# EAGLE design BMS_MCUV1.0 (EAGLE 9.2.0)
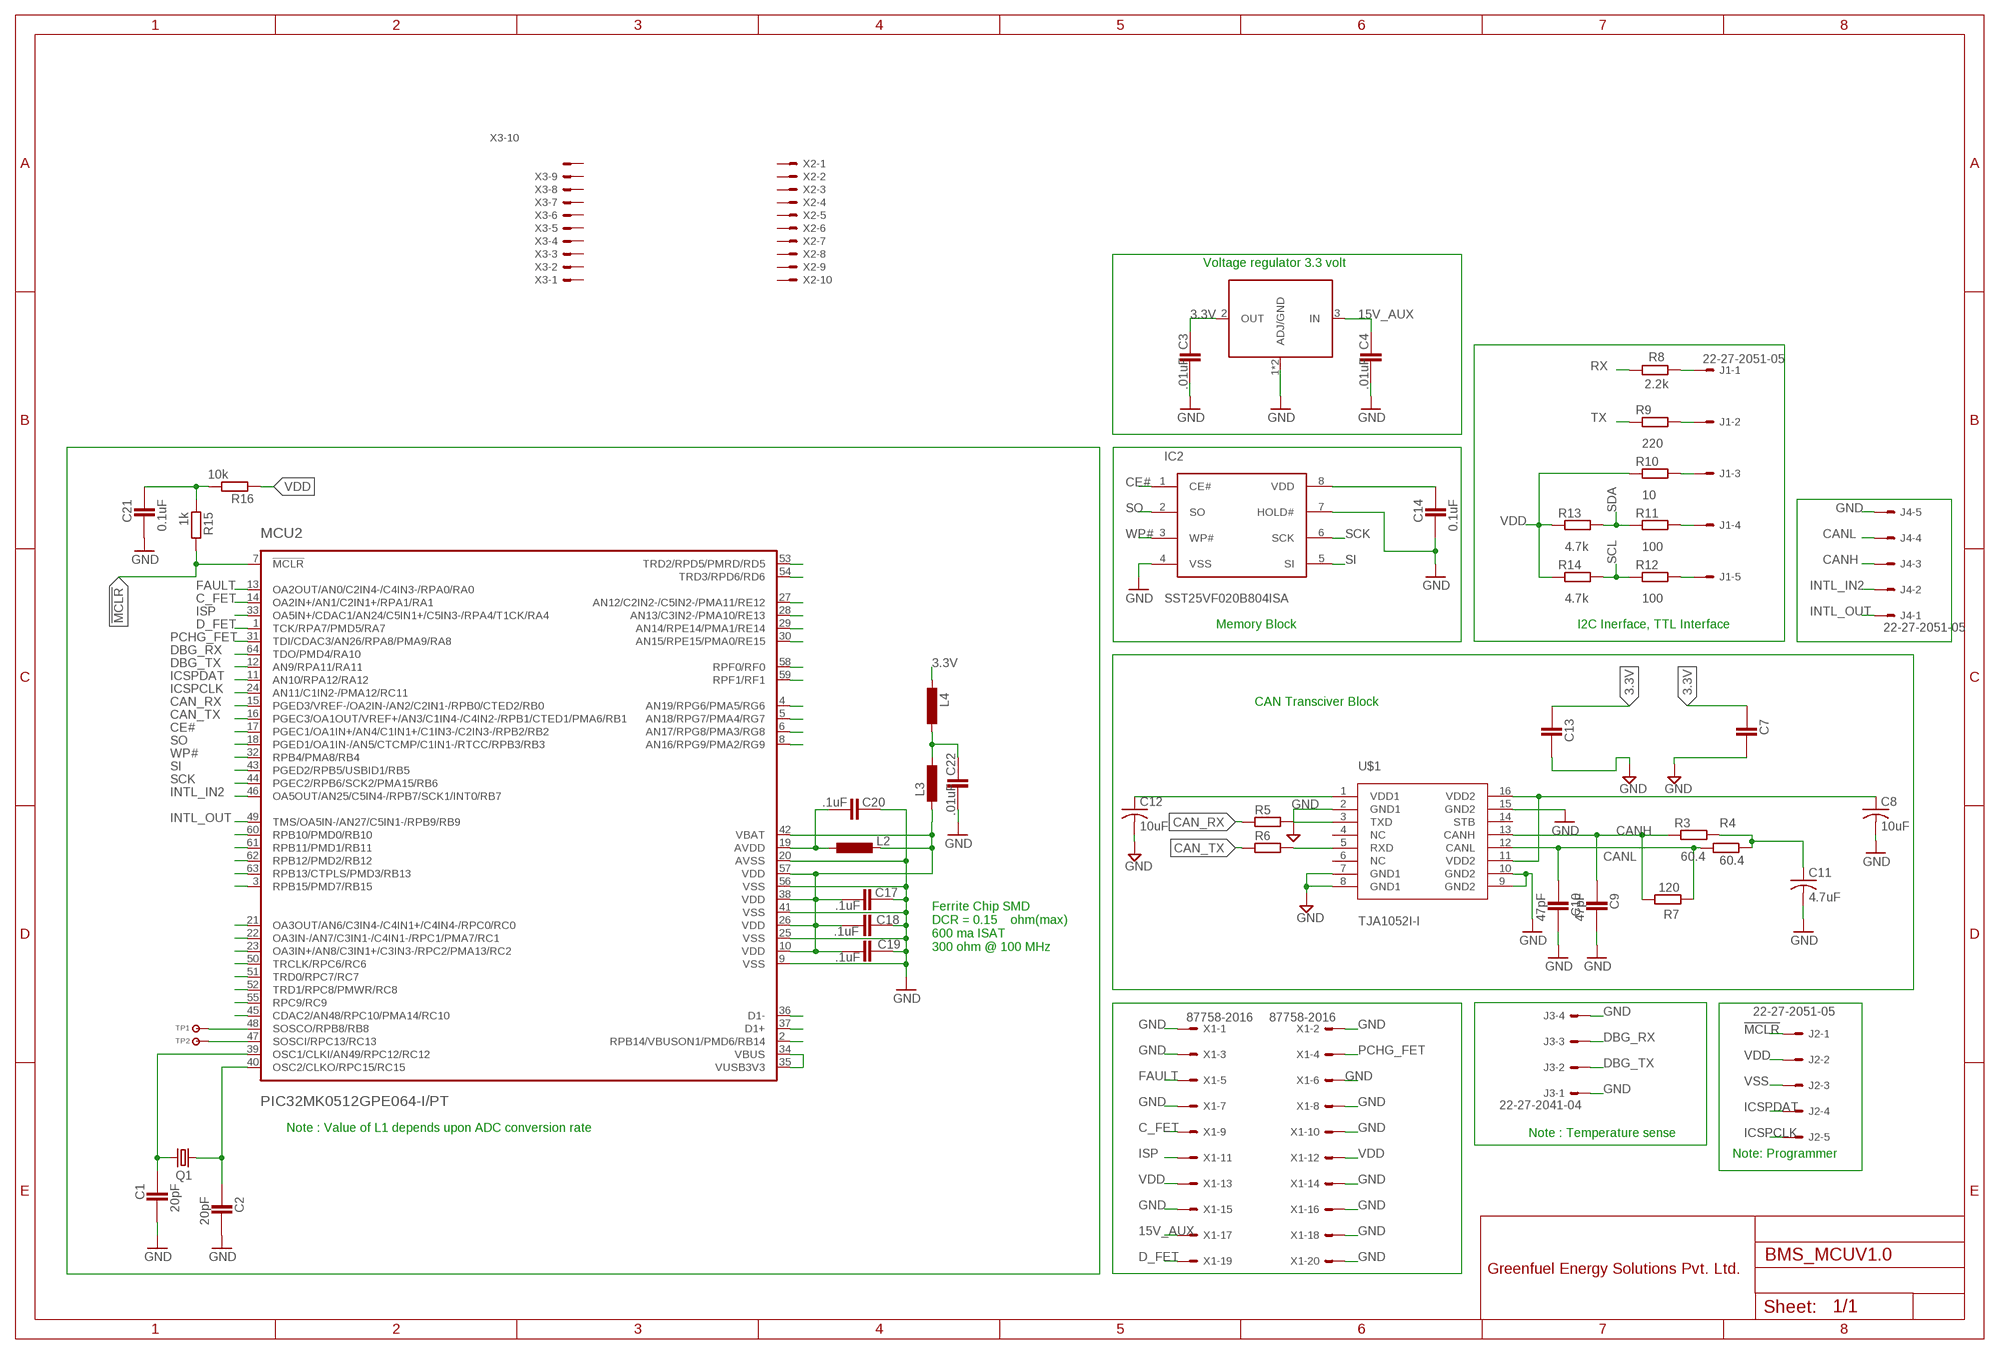
[diagram p0: schematic, sheet 1]

## Parts
C1  20pF  CAPACITOR_0603  [CAPC1608X92N]
C2  20pF  CAPACITOR_0603  [CAPC1608X92N]
C3  .01uF  CAPACITOR_0603  [CAPC1608X92N]
C4  .01uF  CAPACITOR_0603  [CAPC1608X92N]
C7  CAPACITOR_0805  [CAPC2012X145AN]
C8  10uF  C-USC0805  [C0805]
C9  47pF  CAPACITOR_0805  [CAPC2012X145AN]
C10  47pF  CAPACITOR_0805  [CAPC2012X145AN]
C11  4.7uF  C-USC0805  [C0805]
C12  10uF  C-USC0805  [C0805]
C13  CAPACITOR_0805  [CAPC2012X145AN]
C14  0.1uF  CAPACITOR_0603  [CAPC1608X92N]
C17  .1uF  CAPACITOR_0603  [CAPC1608X92N]
C18  .1uF  CAPACITOR_0603  [CAPC1608X92N]
C19  .1uF  CAPACITOR_0603  [CAPC1608X92N]
C20  .1uF  CAPACITOR_0603  [CAPC1608X92N]
C21  0.1uF  CAPACITOR_0603  [CAPC1608X92N]
C22  .01uF  CAPACITOR_0603  [CAPC1608X92N]
IC2  SST25VF020B804ISA  [SOIC127P600X175-8N]
J1  22-27-2051-05  [6410-05]
J2  22-27-2051-05  [6410-05]
J3  22-27-2041-04  [6410-04]
J4  22-27-2051-05  [6410-05]
L2  INDUCTOR_0603  [INDC1608X95N]
L3  INDUCTOR_0603  [INDC1608X95N]
L4  INDUCTOR_0603  [INDC1608X95N]
MCU2  PIC32MK0512GPE064-I/PT  [TQFP-64-I/PT]
Q1  CRYSTALCTS406  [CTS406]
R3  60.4  RESISTOR_0805  [RESC2012X70N]
R4  60.4  RESISTOR_0805  [RESC2012X70N]
R5  RESISTOR_0805  [RESC2012X70N]
R6  RESISTOR_0805  [RESC2012X70N]
R7  120  RESISTOR_0805  [RESC2012X70N]
R8  2.2k  RESISTOR_0805  [RESC2012X70N]
R9  220  RESISTOR_0805  [RESC2012X70N]
R10  10  RESISTOR_0805  [RESC2012X70N]
R11  100  RESISTOR_0805  [RESC2012X70N]
R12  100  RESISTOR_0805  [RESC2012X70N]
R13  4.7k  RESISTOR_0805  [RESC2012X70N]
R14  4.7k  RESISTOR_0805  [RESC2012X70N]
R15  1k  RESISTOR_0603  [RESC1608X55N]
R16  10k  RESISTOR_0603  [RESC1608X55N]
TP1  TP-SMD60  [TP-SMD60]
TP2  TP-SMD60  [TP-SMD60]
U1  NCP1117LP-PG  [SOT-223]
U$1  TJA1052I-I  [SOT162-1]
X1  87758-2016  [87758-2016]
X2  KK-156-10  [KK-156-10]
X3  KK-156-10  [KK-156-10]

## Nets
3.3V: C3.2 C7.1 C13.1 L4.1 U1.2(OUT)
15V_AUX: C4.2 U1.3(IN) X1.17
!MCLR: J2.1 MCU2.7(!MCLR) R15.2
C_FET: MCU2.14(OA2IN+/AN1/C2IN1+/RPA1/RA1) X1.9
CAN_RX: MCU2.15(PGED3/VREF-/OA2IN-/AN2/C2IN1-/RPB0/CTED2/RB0) R5.1
CAN_TX: MCU2.16(PGEC3/OA1OUT/VREF+/AN3/C1IN4-/C4IN2-/RPB1/CTED1/PMA6/RB1) R6.1
CANH: C9.1 J4.3 R3.1 R7.2 U$1.13(CANH)
CANL: C10.1 J4.4 R4.1 R7.1 U$1.12(CANL)
CE#: IC2.1(CE#) MCU2.17(PGEC1/OA1IN+/AN4/C1IN1+/C1IN3-/C2IN3-/RPB2/RB2)
D_FET: MCU2.1(TCK/RPA7/PMD5/RA7) X1.19
DBG_RX: J3.3 MCU2.64(TDO/PMD4/RA10)
DBG_TX: J3.2 MCU2.12(AN9/RPA11/RA11)
FAULT: MCU2.13(OA2OUT/AN0/C2IN4-/C4IN3-/RPA0/RA0) X1.5
GND: C1.2 C2.2 C3.1 C4.1 C7.2 C8.2 C9.2 C10.2 C11.2 C12.2 C13.2 C14.2 C17.2 C18.2 C19.2 C20.2 C21.2 C22.1 IC2.4(VSS) IC2.7(HOLD#) J3.1 J3.4 J4.5 MCU2.9(VSS) MCU2.20(AVSS) MCU2.25(VSS) MCU2.41(VSS) MCU2.56(VSS) U1.1(ADJ/GND) U1.4(ADJ/GND) U$1.2(GND1) U$1.7(GND1) U$1.8(GND1) U$1.9(GND2) U$1.10(GND2) U$1.15(GND2) X1.1 X1.2 X1.3 X1.6 X1.7 X1.8 X1.10 X1.14 X1.15 X1.16 X1.18 X1.20
ICSPCLK: J2.5 MCU2.24(AN11/C1IN2-/PMA12/RC11)
ICSPDAT: J2.4 MCU2.11(AN10/RPA12/RA12)
INTL_IN2: J4.2 MCU2.46(OA5OUT/AN25/C5IN4-/RPB7/SCK1/INT0/RB7)
INTL_OUT: J4.1 MCU2.49(TMS/OA5IN-/AN27/C5IN1-/RPB9/RB9)
ISP: MCU2.33(OA5IN+/CDAC1/AN24/C5IN1+/C5IN3-/RPA4/T1CK/RA4) X1.11
N$1: C1.1 MCU2.39(OSC1/CLKI/AN49/RPC12/RC12) Q1.3
N$2: C2.1 MCU2.40(OSC2/CLKO/RPC15/RC15) Q1.1
N$5: MCU2.48(SOSCO/RPB8/RB8) TP1.P$1
N$6: R6.2 U$1.5(RXD)
N$7: R5.2 U$1.3(TXD)
N$8: C12.1 U$1.1(VDD1)
N$9: MCU2.53(TRD2/RPD5/PMRD/RD5)
N$10: MCU2.54(TRD3/RPD6/RD6)
N$11: C11.1 R3.2 R4.2
N$12: C8.1 U$1.11(VDD2) U$1.16(VDD2)
N$14: C14.1 IC2.8(VDD)
N$16: MCU2.47(SOSCI/RPC13/RC13) TP2.P$1
N$18: J1.1 R8.2
N$19: J1.2 R9.2
N$20: J1.3 R10.2
N$21: J1.4 R11.2
N$22: J1.5 R12.2
N$29: MCU2.27(AN12/C2IN2-/C5IN2-/PMA11/RE12)
N$30: MCU2.28(AN13/C3IN2-/PMA10/RE13)
N$32: C20.1 L2.1 MCU2.19(AVDD)
N$33: C22.2 L3.2 L4.2
N$34: C21.1 R15.1 R16.2
N$40: MCU2.29(AN14/RPE14/PMA1/RE14)
N$41: MCU2.30(AN15/RPE15/PMA0/RE15)
N$42: MCU2.58(RPF0/RF0)
N$43: MCU2.59(RPF1/RF1)
N$44: MCU2.4(AN19/RPG6/PMA5/RG6)
N$45: MCU2.5(AN18/RPG7/PMA4/RG7)
N$46: MCU2.6(AN17/RPG8/PMA3/RG8)
N$47: MCU2.8(AN16/RPG9/PMA2/RG9)
N$66: MCU2.60(RPB10/PMD0/RB10)
N$67: MCU2.61(RPB11/PMD1/RB11)
N$68: MCU2.62(RPB12/PMD2/RB12)
N$69: MCU2.63(RPB13/CTPLS/PMD3/RB13)
N$70: MCU2.3(RPB15/PMD7/RB15)
N$71: MCU2.21(OA3OUT/AN6/C3IN4-/C4IN1+/C4IN4-/RPC0/RC0)
N$72: MCU2.22(OA3IN-/AN7/C3IN1-/C4IN1-/RPC1/PMA7/RC1)
N$73: MCU2.23(OA3IN+/AN8/C3IN1+/C3IN3-/RPC2/PMA13/RC2)
N$74: MCU2.50(TRCLK/RPC6/RC6)
N$75: MCU2.51(TRD0/RPC7/RC7)
N$76: MCU2.52(TRD1/RPC8/PMWR/RC8)
N$77: MCU2.55(RPC9/RC9)
N$78: MCU2.45(CDAC2/AN48/RPC10/PMA14/RC10)
N$79: MCU2.36(D1-)
N$80: MCU2.37(D1+)
N$81: MCU2.2(RPB14/VBUSON1/PMD6/RB14)
N$82: MCU2.34(VBUS) MCU2.35(VUSB3V3)
PCHG_FET: MCU2.31(TDI/CDAC3/AN26/RPA8/PMA9/RA8) X1.4
RX: R8.1
SCK: IC2.6(SCK) MCU2.44(PGEC2/RPB6/SCK2/PMA15/RB6)
SCL: R12.1 R14.2
SDA: R11.1 R13.2
SI: IC2.5(SI) MCU2.43(PGED2/RPB5/USBID1/RB5)
SO: IC2.2(SO) MCU2.18(PGED1/OA1IN-/AN5/CTCMP/C1IN1-/RTCC/RPB3/RB3)
TX: R9.1
VDD: C17.1 C18.1 C19.1 J2.2 L2.2 L3.1 MCU2.10(VDD) MCU2.26(VDD) MCU2.38(VDD) MCU2.42(VBAT) MCU2.57(VDD) R10.1 R13.1 R14.1 R16.1 X1.12 X1.13
VSS: J2.3
WP#: IC2.3(WP#) MCU2.32(RPB4/PMA8/RB4)
Unconnected: U$1.4(NC) U$1.6(NC) U$1.14(STB) X2.1 X2.2 X2.3 X2.4 X2.5 X2.6 X2.7 X2.8 X2.9 X2.10 X3.1 X3.2 X3.3 X3.4 X3.5 X3.6 X3.7 X3.8 X3.9 X3.10

## Notes on the sheet
- Voltage regulator 3.3 volt
- Memory Block | I2C Inerface, TTL Interface
- CAN Transciver Block
- Ferrite Chip SMD
  DCR = 0.15ȍ ohm(max)
  600 ma ISAT
  300 ohm @ 100 MHz
- Note : Value of L1 depends upon ADC conversion rate
- Note : Temperature sense
- Note: Programmer
- Greenfuel Energy Solutions Pvt. Ltd.

## Library data of the parts
C1-C4 C7 C9 C10 C13 C14 C17-C22 = ipc-7351-capacitor:CAPACITOR_
C8 C11 C12 = adafruit:C-US: CAPACITOR, American symbol
IC2 = GreenFuel:SST25VF020B804ISA
J1 J2 J4 = con-molex:22-?-05: CONNECTOR wire to board 2.54 mm (.1 inch) pitch header; MF: MOLEX; OC_FARNELL: unknown; OC_NEWARK: unknown
J3 = con-molex:22-?-04: CONNECTOR wire to board 2.54 mm (.1 inch) pitch header; MF: MOLEX; OC_FARNELL: unknown; OC_NEWARK: unknown
L2-L4 = ipc-7351-inductor:INDUCTOR_
MCU2 = GreenFuel:PIC32MK0512GPE064-I/PT
Q1 = adafruit:CRYSTAL: CRYSTAL; OC_FARNELL: unknown; OC_NEWARK: unknown
R3-R16 = ipc-7351-resistor:RESISTOR_
TP1 TP2 = simpa:TP
U1 = GreenFuel:NCP1117LP
U$1 = GreenFuel:TJA1052I: TJA1052i - Galvanically isolated high-speed CAN transceiver Specification : Type : SOT162-1 Manufacture : NXP Manufacture PN: TJA1052i Certifications: ISO 11898-2:2003 compliant Suitable for use in 12 V and 24 V systems; compatible with 3 V to 5 V microcontrollers Supporting Material TJA1052i Datasheet <https://www.nxp.com/docs/en/data-sheet/TJA1052I.pdf>
X1 = con-molex:87758-2016: 20 Pin - 2mm Dual Row Single Wafer, Vertical T/H HDR Source: http://www.molex.com/pdm_docs/sd/877580616_sd.pdf; MF: MOLEX; MPN: 87758-2016; OC_FARNELL: 7472374; OC_NEWARK: 25M5677
X2 X3 = con-molex:KK-156-10: KK 156 HEADER Source: http://www.molex.com/pdm_docs/sd/026604100_sd.pdf; MF: MOLEX; OC_FARNELL: unknown; OC_NEWARK: unknown

## Board
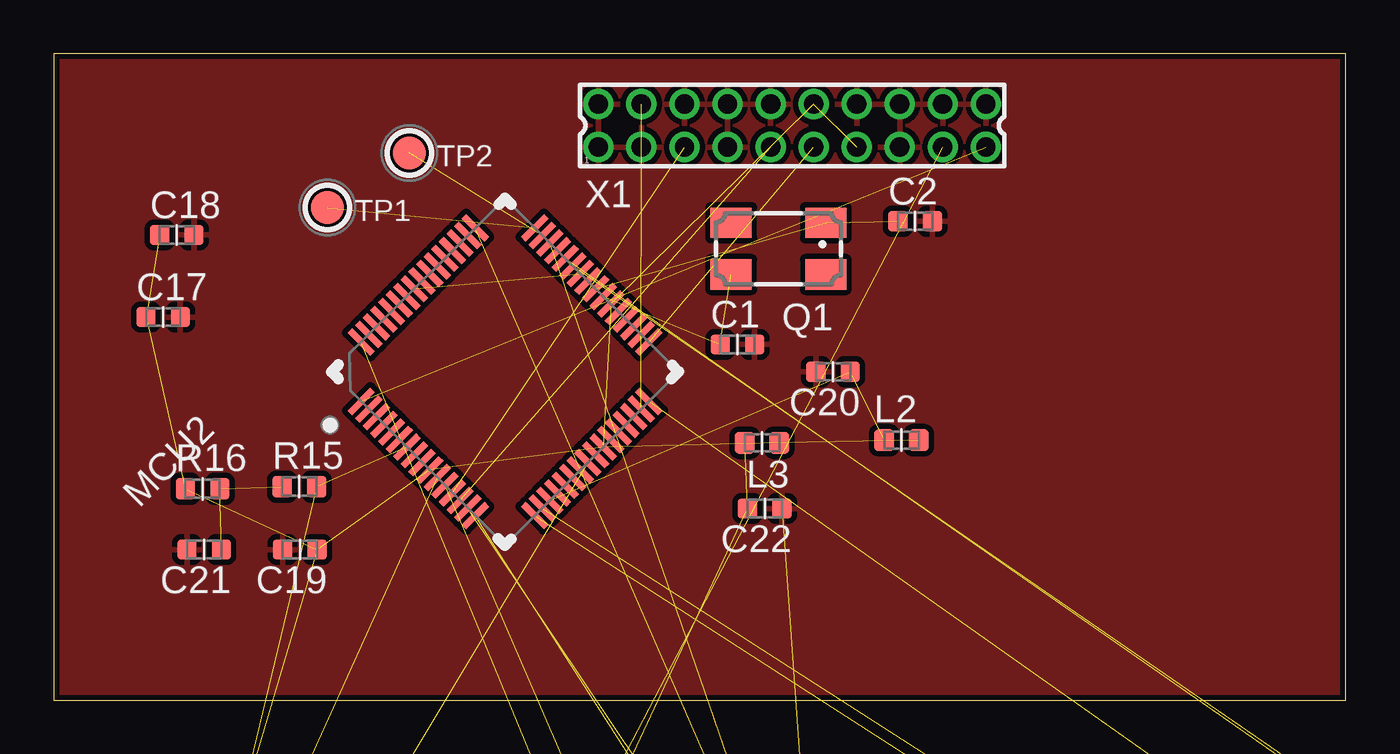
[diagram p1: board, top side]
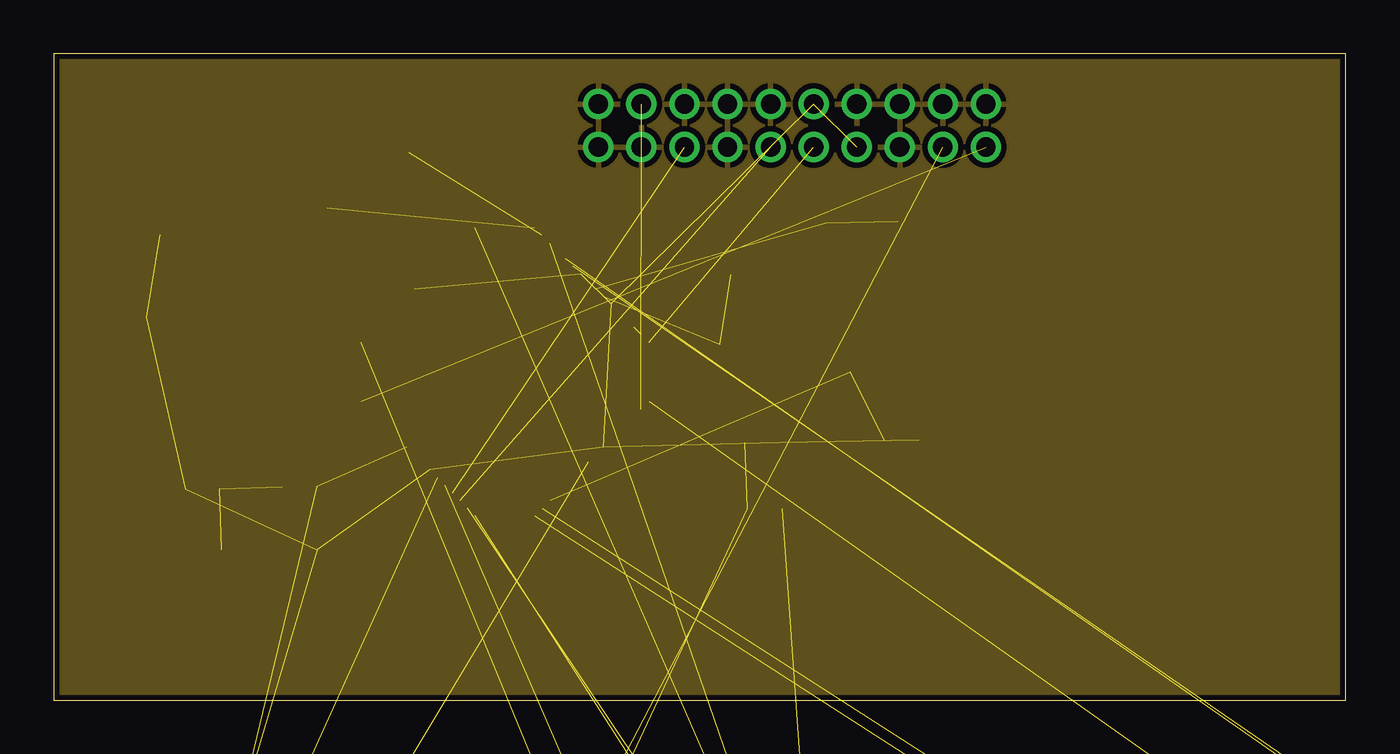
[diagram p2: board, inner layer Route2]
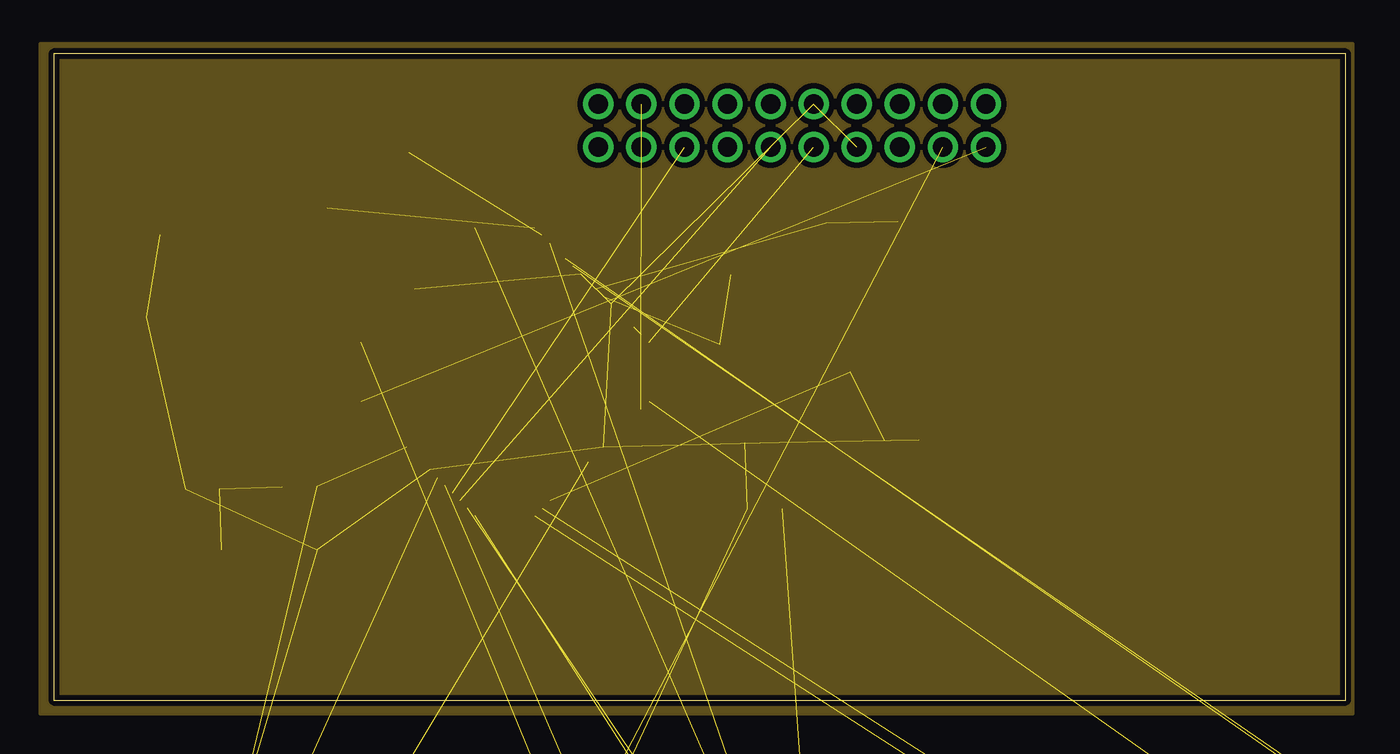
[diagram p3: board, inner layer Route15]
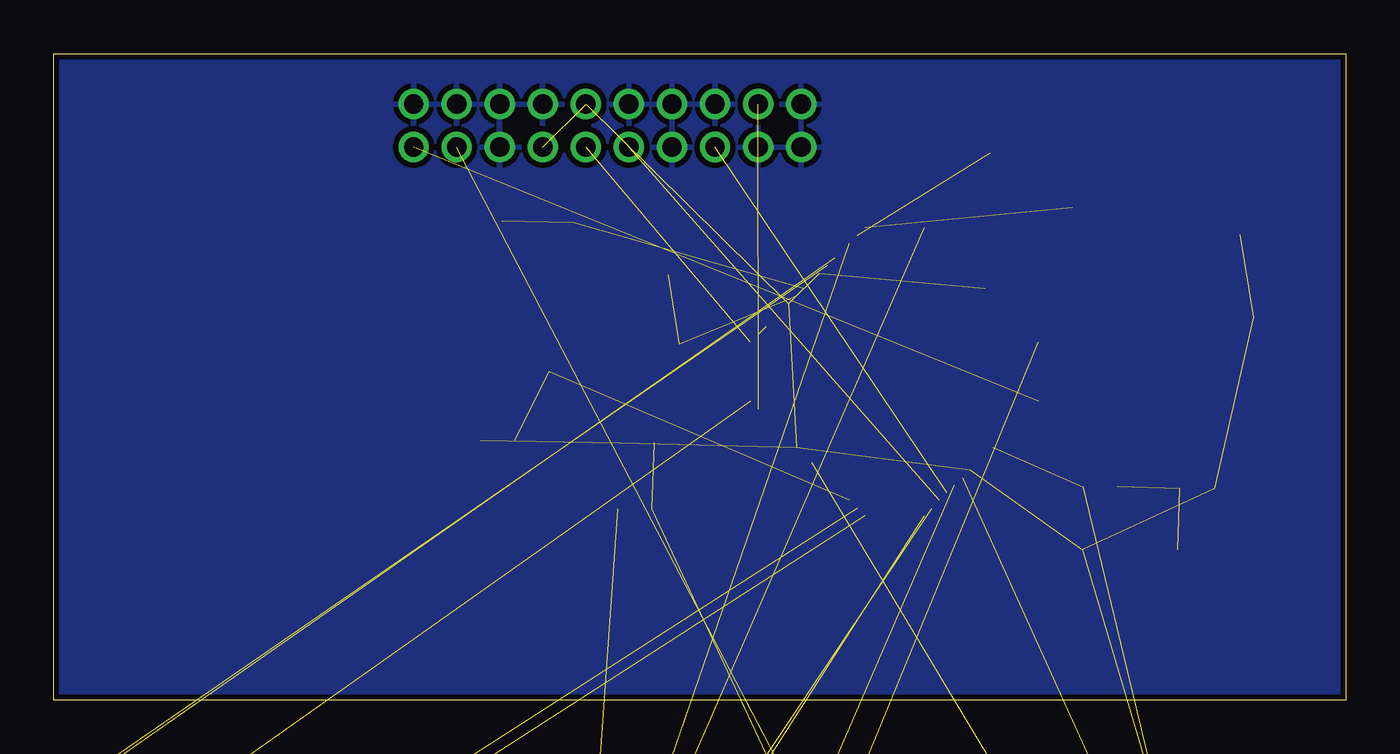
[diagram p4: board, bottom side, seen from below]

Size 60 x 30 mm. Coordinates in mm from the lower left corner, seen from the top.
Outline: 0,0 60,0 60,30 0,30 0,0
Copper layers [15:((1+2)*(15+16)):2]: Top 0.035mm / dielectric 0.09238125mm / Route2 0.035mm / dielectric 1.2304mm / Route15 0.035mm / dielectric 0.09238125mm / Bottom 0.035mm
Design rules "default *": minimum track width 6mil, minimum drill 12mil, track to track 10mil, track to pad 8mil, pad to pad 6mil, via to via 10mil, smd to smd 0mil, copper to edge 10mil, drill to drill 10mil, minimum pad ring 10mil, minimum via ring 6mil, stop-mask expansion 2mil, vias tented up to drill 100mil, thermal gap 10mil

### Footprints (pad centres in the part's own frame; a part is rotated, then mirrored left to right if it is on the bottom)
CAPC1608X92N = smd 0.9 x 0.95: 1 -0.8,0; 2 0.8,0
CAPC2012X145AN = smd 1.15 x 1.45: 1 -0.9,0; 2 0.9,0
C0805 = smd 1.3 x 1.5: 1 -0.85,0; 2 0.85,0
SOIC127P600X175-8N = smd 1.9 x 0.6: 1 -2.455,1.905; 2 -2.455,0.635; 3 -2.455,-0.635; 4 -2.455,-1.905; 5 2.455,-1.905; 6 2.455,-0.635; 7 2.455,0.635; 8 2.455,1.905
6410-05 = drill 1.016 long: 1 5.08,0; 2 2.54,0; 3 0,0; 4 -2.54,0; 5 -5.08,0
6410-04 = drill 1.016 long: 1 3.81,0; 2 1.27,0; 3 -1.27,0; 4 -3.81,0
INDC1608X95N = smd 0.95 x 1: 1 -0.8,0; 2 0.8,0
TQFP-64-I/PT = smd 1.5 x 0.3: 1 -5.7,3.75; 2 -5.7,3.25; 3 -5.7,2.75; 4 -5.7,2.25; 5 -5.7,1.75; 6 -5.7,1.25; 7 -5.7,0.75; 8 -5.7,0.25; 9 -5.7,-0.25; 10 -5.7,-0.75; 11 -5.7,-1.25; 12 -5.7,-1.75; 13 -5.7,-2.25; 14 -5.7,-2.75; 15 -5.7,-3.25; 16 -5.7,-3.75; 33 5.7,-3.75; 34 5.7,-3.25; 35 5.7,-2.75; 36 5.7,-2.25; 37 5.7,-1.75; 38 5.7,-1.25; 39 5.7,-0.75; 40 5.7,-0.25; 41 5.7,0.25; 42 5.7,0.75; 43 5.7,1.25; 44 5.7,1.75; 45 5.7,2.25; 46 5.7,2.75; 47 5.7,3.25; 48 5.7,3.75 | smd 0.3 x 1.5: 17 -3.75,-5.7; 18 -3.25,-5.7; 19 -2.75,-5.7; 20 -2.25,-5.7; 21 -1.75,-5.7; 22 -1.25,-5.7; 23 -0.75,-5.7; 24 -0.25,-5.7; 25 0.25,-5.7; 26 0.75,-5.7; 27 1.25,-5.7; 28 1.75,-5.7; 29 2.25,-5.7; 30 2.75,-5.7; 31 3.25,-5.7; 32 3.75,-5.7; 49 3.75,5.7; 50 3.25,5.7; 51 2.75,5.7; 52 2.25,5.7; 53 1.75,5.7; 54 1.25,5.7; 55 0.75,5.7; 56 0.25,5.7; 57 -0.25,5.7; 58 -0.75,5.7; 59 -1.25,5.7; 60 -1.75,5.7; 61 -2.25,5.7; 62 -2.75,5.7; 63 -3.25,5.7; 64 -3.75,5.7
CTS406 = smd 1.9 x 1.4: 1 -2.2,-1.2; 2 2.2,-1.2; 3 2.2,1.2; 4 -2.2,1.2
RESC2012X70N = smd 1.05 x 1.4: 1 -0.95,0; 2 0.95,0
RESC1608X55N = smd 0.9 x 1: 1 -0.8,0; 2 0.8,0
TP-SMD60 = smd 1.524 x 1.524: P$1 0,0
SOT-223 = smd 1.5 x 2: 1 -2.3,-3.15; 2 0,-3.15; 3 2.3,-3.15 | smd 3.8 x 2: 4 0,3.15
SOT162-1 = smd 2.05 x 0.6: 1 -4.655,4.445; 2 -4.655,3.175; 3 -4.655,1.905; 4 -4.655,0.635; 5 -4.655,-0.635; 6 -4.655,-1.905; 7 -4.655,-3.175; 8 -4.655,-4.445; 9 4.655,-4.445; 10 4.655,-3.175; 11 4.655,-1.905; 12 4.655,-0.635; 13 4.655,0.635; 14 4.655,1.905; 15 4.655,3.175; 16 4.655,4.445
87758-2016 = drill 0.9 pad 1.27: 1 -9,-1; 2 -9,1; 3 -7,-1; 4 -7,1; 5 -5,-1; 6 -5,1; 7 -3,-1; 8 -3,1; 9 -1,-1; 10 -1,1; 11 1,-1; 12 1,1; 13 3,-1; 14 3,1; 15 5,-1; 16 5,1; 17 7,-1; 18 7,1; 19 9,-1; 20 9,1
KK-156-10 = drill 1.7 pad 2.184 long: 1 -17.82,0; 2 -13.86,0; 3 -9.9,0; 4 -5.94,0; 5 -1.98,0; 6 1.98,0; 7 5.94,0; 8 9.9,0; 9 13.86,0; 10 17.82,0

### Placement (x,y rotation side)
C1  31.75,16.51 0 top
C2  40.01,22.23 0 top
C3  13.46,-50.29 180 top  (outside the outline)
C4  13.34,-71.25 0 top  (outside the outline)
C7  13.34,-57.78 0 top  (outside the outline)
C8  78.79,-57.15 0 top  (outside the outline)
C9  78.87,-60.83 180 top  (outside the outline)
C10  78.66,-64.77 180 top  (outside the outline)
C11  79.38,-71.12 0 top  (outside the outline)
C12  80.01,-76.2 0 top  (outside the outline)
C13  13.72,-54.86 180 top  (outside the outline)
C14  77.47,-25.53 0 top  (outside the outline)
C17  5.08,17.78 0 top
C18  5.71,21.59 0 top
C19  11.43,6.99 180 top
C20  36.2,15.24 180 top
C21  6.99,6.99 180 top
C22  33.02,8.89 180 top
IC2  140.97,-64.14 90 top  (outside the outline)
J1  -8.26,-77.47 90 top  (outside the outline)
J2  -7.62,-51.44 0 top  (outside the outline)
J3  45.09,-55.24 0 top  (outside the outline)
J4  42.55,-42.55 0 top  (outside the outline)
L2  39.37,12.06 0 top
L3  32.89,11.94 180 top
L4  13.97,-28.57 0 top  (outside the outline)
MCU2  20.95,15.24 45 top
Q1  33.66,20.95 180 top
R3  79.38,-67.94 0 top  (outside the outline)
R4  78.11,-41.27 0 top  (outside the outline)
R5  80.64,-81.28 0 top  (outside the outline)
R6  80.64,-85.09 0 top  (outside the outline)
R7  78.87,-50.04 0 top  (outside the outline)
R8  12.7,-67.94 0 top  (outside the outline)
R9  13.34,-74.3 0 top  (outside the outline)
R10  13.97,-77.47 180 top  (outside the outline)
R11  13.34,-83.82 180 top  (outside the outline)
R12  13.97,-87.63 180 top  (outside the outline)
R13  13.34,-64.77 180 top  (outside the outline)
R14  13.41,-80.64 0 top  (outside the outline)
R15  11.4,9.91 0 top
R16  6.91,9.8 0 top
TP1  12.7,22.86 0 top
TP2  16.51,25.4 0 top
U1  -6.99,-62.87 90 top  (outside the outline)
U$1  97.79,-79.38 180 top  (outside the outline)
X1  34.29,26.67 0 top
X2  6.99,-95.89 0 top  (outside the outline)
X3  6.99,-106.05 0 top  (outside the outline)

### Tracks (layer width: path | path; a pad name or v marks a point on that pad's centre or on a via)
3.3V  (4 unrouted)
  pour Route15: -0.64,30.48 60.33,30.48 60.33,-0.64 -0.64,-0.64
15V_AUX  (2 unrouted)
!MCLR  (2 unrouted)
C_FET  (1 unrouted)
CAN_RX  (1 unrouted)
CAN_TX  (1 unrouted)
CANH  (4 unrouted)
CANL  (4 unrouted)
CE#  (1 unrouted)
D_FET  (1 unrouted)
DBG_RX  (1 unrouted)
DBG_TX  (1 unrouted)
FAULT  (1 unrouted)
GND  (23 unrouted)
  pour Top (rank 6): -0.64,30.48 60.33,30.48 60.33,-0.64 -0.64,-0.64
  pour Route2: -0.64,30.48 60.33,30.48 60.33,-0.64 -0.64,-0.64
  pour Bottom (rank 6): -0.64,30.48 60.33,30.48 60.33,-0.64 -0.64,-0.64
ICSPCLK  (1 unrouted)
ICSPDAT  (1 unrouted)
INTL_IN2  (1 unrouted)
INTL_OUT  (1 unrouted)
ISP  (1 unrouted)
N$1  (2 unrouted)
N$2  (2 unrouted)
N$5  (1 unrouted)
N$6  (1 unrouted)
N$7  (1 unrouted)
N$8  (1 unrouted)
N$11  (2 unrouted)
N$12  (2 unrouted)
N$14  (1 unrouted)
N$16  (1 unrouted)
N$18  (1 unrouted)
N$19  (1 unrouted)
N$20  (1 unrouted)
N$21  (1 unrouted)
N$22  (1 unrouted)
N$32  (2 unrouted)
N$33  (2 unrouted)
N$34  (2 unrouted)
N$82  (1 unrouted)
PCHG_FET  (1 unrouted)
SCK  (1 unrouted)
SCL  (1 unrouted)
SDA  (1 unrouted)
SI  (1 unrouted)
SO  (1 unrouted)
VDD  (16 unrouted)
WP#  (1 unrouted)